# Altium schematic sheet 7688A参考设计原理图.schdoc
size A3
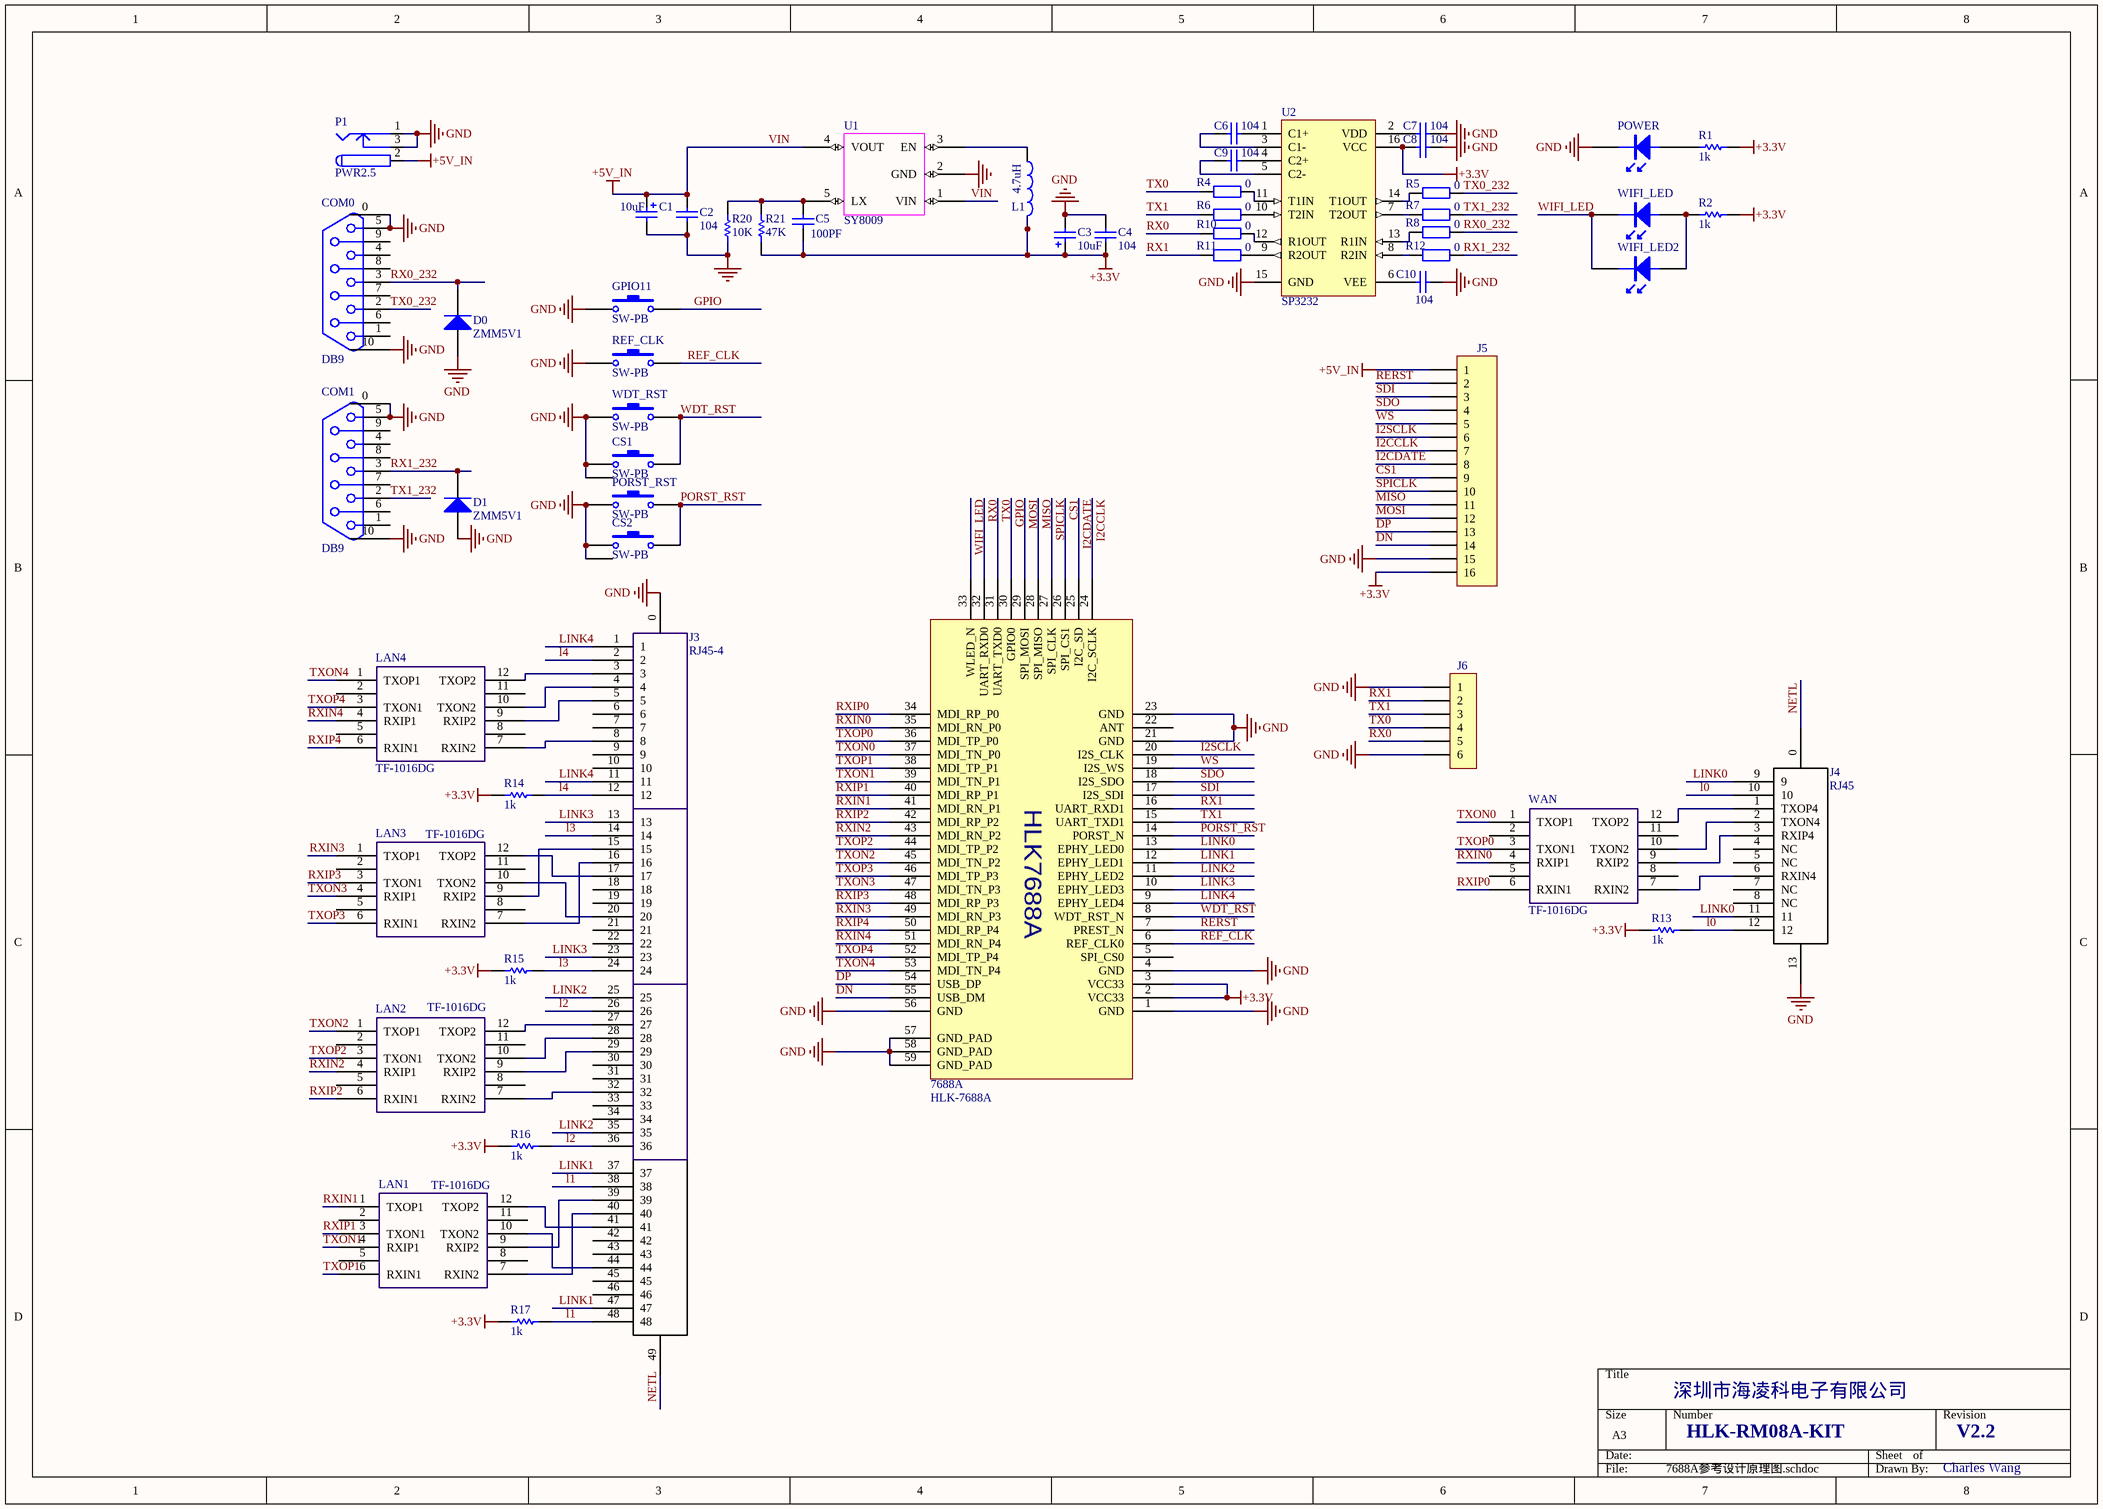
[diagram p0: 7688A参考设计原理图.schdoc]

## Parts
7688A  HLK-7688A  [7688A]
C1  10uF  [0805]
C2  104  [0603L]
C3  10uF  [0805]
C4  104  [0603L]
C5  100PF  [0603L]
C6  104  [0603]
C7  104  [0603]
C8  104  [0603]
C9  104  [0603]
C10  104  [0603]
COM0  DB9  [DB9s]
COM1  DB9  [DB9s]
CS1  SW-PB  [K5]
CS2  SW-PB  [K5]
D0  ZMM5V1  [1005D]
D1  ZMM5V1  [1005D]
GPIO11  SW-PB  [SWITCH]
J3  RJ45-4  [RJ45-4-LED]
J4  RJ45
J5  2.54*16  [HDR1X16]  (value not drawn)
J6  2.54*6  (value not drawn)
L1  4.7uH  [L322520]
LAN1  TF-1016DG  [tf-1016dg]
LAN2  TF-1016DG  [tf-1016dg]
LAN3  TF-1016DG  [tf-1016dg]
LAN4  TF-1016DG  [tf-1016dg]
P1  PWR2.5  [POWER_STK1]
PORST_RST  SW-PB  [SWITCH]
POWER  (no value)  [0603LED]
R1  value 1k  [0603]  (hidden comment: Res1)
R2  value 1k  [0603]  (hidden comment: Res1)
R4  0  [0603]
R5  0  [0603]
R6  0  [0603]
R7  0  [0603]
R8  0  [0603]
R10  0  [0603]
R11  0  [0603]
R12  0  [0603]
R13  value 1k  [0603]  (hidden comment: Res1)
R14  value 1k  [0603]  (hidden comment: Res1)
R15  value 1k  [0603]  (hidden comment: Res1)
R16  value 1k  [0603]  (hidden comment: Res1)
R17  value 1k  [0603]  (hidden comment: Res1)
R20  value 10K  [0603L]  (hidden comment: Res1)
R21  value 47K  [0603L]  (hidden comment: Res1)
REF_CLK  SW-PB  [SWITCH]
U1  SY8009  [SOT-25]
U2  SP3232  [MAX3232]
WAN  TF-1016DG  [tf-1016dg]
WDT_RST  SW-PB  [SWITCH]
WIFI_LED  (no value)  [0603LED]
WIFI_LED2  (no value)  [LED0.2]

## Nets
+3.3V: 7688A.2(VCC33) 7688A.3(VCC33) C3.1 C4.1 C5.1 C8.1 J5.16 L1.2 R1.2 R2.2 R13.2 R14.2 R15.2 R16.2 R17.2 R21.2 U2.16(VCC)
GND: 7688A.1(GND) 7688A.4(GND) 7688A.21(GND) 7688A.23(GND) 7688A.56(GND) 7688A.57(GND_PAD) 7688A.58(GND_PAD) 7688A.59(GND_PAD) C1.2 C2.2 C3.2 C4.2 C7.2 C8.2 C10.1 COM0.0 COM0.5 COM0.10 COM1.0 COM1.5 COM1.10 CS1.1 CS1.3 CS2.1 CS2.3 D0.1(A) D1.1(A) GPIO11.1 J3.0 J4.13 J5.15 J6.1 J6.6 P1.1 P1.3 PORST_RST.1 POWER.2 R20.1 REF_CLK.1 U1.2(GND) U2.15(GND) WDT_RST.1
VIN: C1.1 C2.1 J5.1 P1.2 U1.1(VIN) U1.4(VOUT)  [also labelled +5V_IN]
CS1: 7688A.26(SPI_CS1) J5.9
DN: 7688A.55(USB_DM) J5.14
DP: 7688A.54(USB_DP) J5.13
GPIO: 7688A.30(GPIO0) GPIO11.2
I2CCLK: 7688A.24(I2C_SCLK) J5.7
I2CDATE: 7688A.25(I2C_SD) J5.8
I2SCLK: 7688A.20(I2S_CLK) J5.6
l0: J4.10 J4.12 R13.1
l1: J3.38 J3.48 R17.1
l2: J3.26 J3.36 R16.1
l3: J3.14 J3.24 R15.1
l4: J3.2 J3.12 R14.1
LINK0: 7688A.13(EPHY_LED0) J4.9 J4.11
LINK1: 7688A.12(EPHY_LED1) J3.37 J3.47
LINK2: 7688A.11(EPHY_LED2) J3.25 J3.35
LINK3: 7688A.10(EPHY_LED3) J3.13 J3.23
LINK4: 7688A.9(EPHY_LED4) J3.1 J3.11
MISO: 7688A.28(SPI_MISO) J5.11
MOSI: 7688A.29(SPI_MOSI) J5.12
NETL: J3.49 J4.0
PORST_RST: 7688A.14(PORST_N) CS2.2 PORST_RST.2
REF_CLK: 7688A.6(REF_CLK0) REF_CLK.2
RERST: 7688A.7(PREST_N) J5.2
RX0: 7688A.32(UART_RXD0) J6.5 R10.1
RX0_232: COM0.3 D0.2(K) R8.2
RX1: 7688A.16(UART_RXD1) J6.2 R11.1
RX1_232: COM1.3 D1.2(K) R12.2
RXIN0: 7688A.35(MDI_RN_P0) WAN.4(RXIP1)
RXIN1: 7688A.41(MDI_RN_P1) LAN1.1(TXOP1)
RXIN2: 7688A.43(MDI_RN_P2) LAN2.4(RXIP1)
RXIN3: 7688A.49(MDI_RN_P3) LAN3.1(TXOP1)
RXIN4: 7688A.51(MDI_RN_P4) LAN4.4(RXIP1)
RXIP0: 7688A.34(MDI_RP_P0) WAN.6(RXIN1)
RXIP1: 7688A.40(MDI_RP_P1) LAN1.3(TXON1)
RXIP2: 7688A.42(MDI_RP_P2) LAN2.6(RXIN1)
RXIP3: 7688A.48(MDI_RP_P3) LAN3.3(TXON1)
RXIP4: 7688A.50(MDI_RP_P4) LAN4.6(RXIN1)
SDI: 7688A.17(I2S_SDI) J5.3
SDO: 7688A.18(I2S_SDO) J5.4
SPICLK: 7688A.27(SPI_CLK) J5.10
TX0: 7688A.31(UART_TXD0) J6.4 R4.1
TX0_232: COM0.2 R5.2
TX1: 7688A.15(UART_TXD1) J6.3 R6.1
TX1_232: COM1.2 R7.2
TXON0: 7688A.37(MDI_TN_P0) WAN.1(TXOP1)
TXON1: 7688A.39(MDI_TN_P1) LAN1.4(RXIP1)
TXON2: 7688A.45(MDI_TN_P2) LAN2.1(TXOP1)
TXON3: 7688A.47(MDI_TN_P3) LAN3.4(RXIP1)
TXON4: 7688A.53(MDI_TN_P4) LAN4.1(TXOP1)
TXOP0: 7688A.36(MDI_TP_P0) WAN.3(TXON1)
TXOP1: 7688A.38(MDI_TP_P1) LAN1.6(RXIN1)
TXOP2: 7688A.44(MDI_TP_P2) LAN2.3(TXON1)
TXOP3: 7688A.46(MDI_TP_P3) LAN3.6(RXIN1)
TXOP4: 7688A.52(MDI_TP_P4) LAN4.3(TXON1)
WDT_RST: 7688A.8(WDT_RST_N) CS1.2 WDT_RST.2
WIFI_LED: 7688A.33(WLED_N) WIFI_LED.2 WIFI_LED2.2
WS: 7688A.19(I2S_WS) J5.5
NetC5_2: C5.2 R20.2 R21.1 U1.5(LX)
NetC6_1: C6.1 U2.3(C1-)
NetC6_2: C6.2 U2.1(C1+)
NetC7_1: C7.1 U2.2(VDD)
NetC9_1: C9.1 U2.5(C2-)
NetC9_2: C9.2 U2.4(C2+)
NetC10_2: C10.2 U2.6(VEE)
NetJ3_3: J3.3 LAN4.12(TXOP2)
NetJ3_4: J3.4 LAN4.10(TXON2)
NetJ3_5: J3.5 LAN4.9(RXIP2)
NetJ3_8: J3.8 LAN4.7(RXIN2)
NetJ3_15: J3.15 LAN3.9(RXIP2)
NetJ3_16: J3.16 LAN3.7(RXIN2)
NetJ3_17: J3.17 LAN3.12(TXOP2)
NetJ3_20: J3.20 LAN3.10(TXON2)
NetJ3_27: J3.27 LAN2.12(TXOP2)
NetJ3_28: J3.28 LAN2.10(TXON2)
NetJ3_29: J3.29 LAN2.9(RXIP2)
NetJ3_32: J3.32 LAN2.7(RXIN2)
NetJ3_39: J3.39 LAN1.9(RXIP2)
NetJ3_40: J3.40 LAN1.7(RXIN2)
NetJ3_41: J3.41 LAN1.12(TXOP2)
NetJ3_44: J3.44 LAN1.10(TXON2)
NetJ4_1: J4.1(TXOP4) WAN.12(TXOP2)
NetJ4_2: J4.2(TXON4) WAN.10(TXON2)
NetJ4_3: J4.3(RXIP4) WAN.9(RXIP2)
NetJ4_6: J4.6(RXIN4) WAN.7(RXIN2)
NetL1_1: L1.1 U1.3(EN)
NetPOWER_1: POWER.1 R1.1
NetR2_1: R2.1 WIFI_LED.1 WIFI_LED2.1
NetR4_2: R4.2 U2.11(T1IN)
NetR5_1: R5.1 U2.14(T1OUT)
NetR6_2: R6.2 U2.10(T2IN)
NetR7_1: R7.1 U2.7(T2OUT)
NetR8_1: R8.1 U2.13(R1IN)
NetR10_2: R10.2 U2.12(R1OUT)
NetR11_2: R11.2 U2.9(R2OUT)
NetR12_1: R12.1 U2.8(R2IN)

Not connected (* = marked no-connect by the designer): 7688A 5(SPI_CS0) 22(ANT); COM0 1 4 6 7 8 9; COM1 1 4 6 7 8 9; J3 6 7 9 10 18 19 21 22 30 31 33 34 42 43 45 46; J4 4(NC) 5(NC) 7(NC) 8(NC); LAN1 2 5 8 11; LAN2 2 5 8 11; LAN3 2 5 8 11; LAN4 2 5 8 11; WAN 2 5 8 11

## Notes on the sheet
- 深圳市海凌科电子有限公司
- HLK-RM08A-KIT
- V2.2
- Charles Wang
- (in symbol Component_1) HLK7688A

## Library data of the parts
7688A LAN1-LAN4 WAN = Component_1
C1 C3 = Cap Pol3: Polarized Capacitor (Surface Mount); Manufacturer: Generic Components; Class: Passive; Published: 08/06/2000; Publisher: Altium Hobart Technology Centre; SubClass: Capacitor; Value: 10uF
C2 C4 = Cap: Capacitor; Manufacturer: Generic Components; Class: Passive; Value: 100pF; Published: 08/06/2000; Publisher: Altium Hobart Technology Centre; SubClass: Capacitor
C5 = Cap: Capacitor; Manufacturer: Generic Components; Class: Passive; Published: 08/06/2000; Publisher: Altium Hobart Technology Centre; SubClass: Capacitor; Value: 100pF
C6-C10 = Cap: Capacitor; Value: 100pF; Published: 8-Jun-2000; LatestRevisionDate: 17-Jul-2002; LatestRevisionNote: Re-released for DXP Platform.; PackageReference: RAD-0.3; Publisher: Altium Limited
CS1 CS2 GPIO11 PORST_RST REF_CLK WDT_RST = SW-PB: Switch; Published: 24-Mar-1999; LatestRevisionDate: 17-Jul-2002; LatestRevisionNote: Re-released for DXP Platform.; PackageReference: SPST-2; Publisher: Altium Limited
D0 D1 = Diode: Default Diode; Published: 8-Jun-2000; LatestRevisionDate: 17-Jul-2002; LatestRevisionNote: Re-released for DXP Platform.; PackageDocument: Sep-1996; PackageReference: SMC; Publisher: Altium Limited; Code_JEDEC: DO-214-AB
J4 = RJ45_1
J5 = CON16: Connector
J6 = CON6: Connector
L1 = INDUCTOR1
P1 = PWR2.5: Low Voltage Power Supply Connector
POWER WIFI_LED WIFI_LED2 = LED
R1 R2 R13-R17 R20 R21 = Res1: Resistor; Published: 8-Jun-2000; LatestRevisionDate: 17-Jul-2002; LatestRevisionNote: Re-released for DXP Platform.; PackageReference: AXIAL-0.3; Publisher: Altium Limited
R4-R8 R10-R12 = Res2: Resistor; Published: 8-Jun-2000; LatestRevisionDate: 17-Jul-2002; LatestRevisionNote: Re-released for DXP Platform.; PackageReference: AXIAL-0.4; Publisher: Altium Limited; Value: 0
U1 = RT8009
U2 = MAX232ACPE: +5V Powered, Multi-Channel RS-232 Driver/Receiver; PackageDocument: 1997; Published: 16-Jan-2001; LatestRevisionDate: 6-Jun-2005; LatestRevisionNote: Stylized 3D Model Added.; PackageReference: PE16A; Publisher: Altium Limited; Code_JEDEC: MS-001-BB; ComponentLink1Description: Manufacturer Link; ComponentLink1URL: http://www.maxim-ic.com/; ComponentLink2Description: Datasheet; ComponentLink2URL: http://pdfserv.maxim-ic.com/en/ds/MAX220-MAX249.pdf